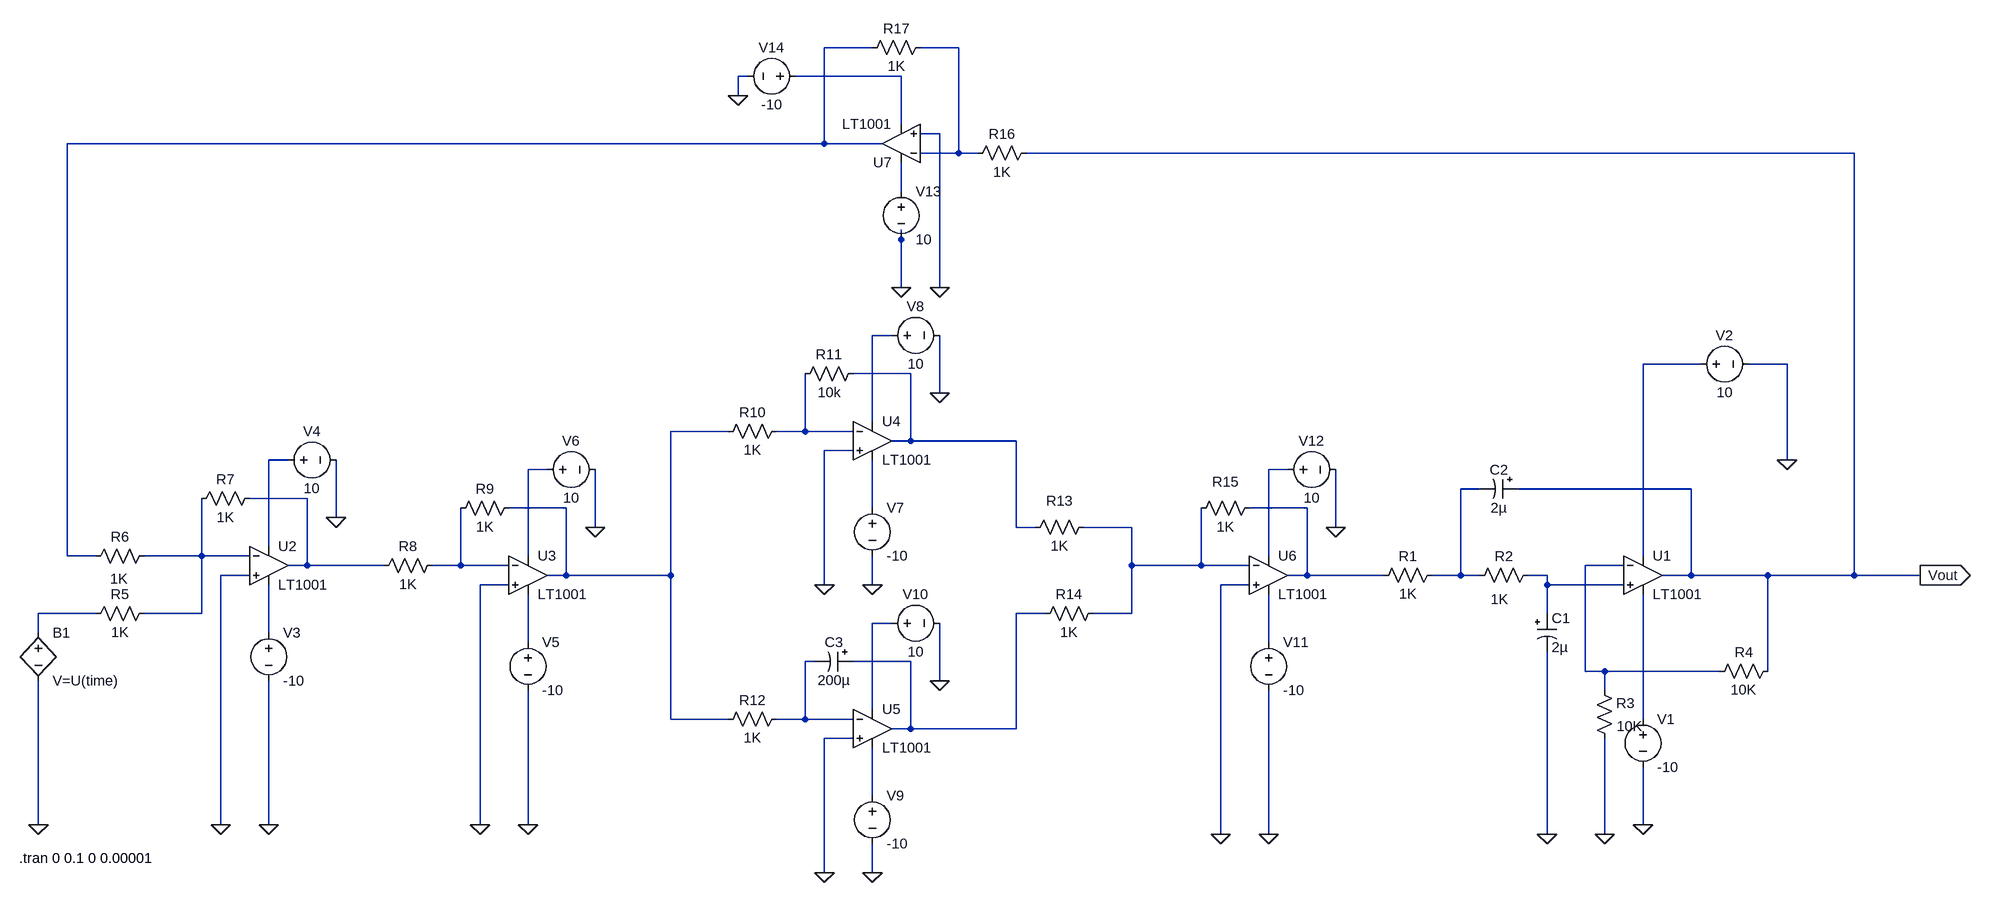
[diagram p0: schematic EC5030_Design Project_2021E171_Design2_Task2.asc]
EC5030_Design Project_2021E171_Design2_Task2.asc, the LTspice schematic file:
Version 4
SHEET 1 2368 1044
WIRE 496 -352 416 -352
WIRE 640 -352 576 -352
WIRE 288 -304 272 -304
WIRE 544 -304 368 -304
WIRE 272 -272 272 -304
WIRE 544 -224 544 -304
WIRE 608 -208 576 -208
WIRE 416 -192 416 -352
WIRE 416 -192 -896 -192
WIRE 512 -192 416 -192
WIRE 640 -176 640 -352
WIRE 640 -176 576 -176
WIRE 672 -176 640 -176
WIRE 2144 -176 752 -176
WIRE 544 -112 544 -160
WIRE 544 -32 544 -48
WIRE 544 48 544 -32
WIRE 608 48 608 -208
WIRE 528 128 496 128
WIRE 1888 176 1792 176
WIRE 2032 176 1968 176
WIRE 560 192 464 192
WIRE 608 224 608 128
WIRE 496 272 496 128
WIRE 256 288 160 288
WIRE 384 288 384 192
WIRE 384 288 336 288
WIRE 464 288 384 288
WIRE 560 304 560 192
WIRE 560 304 528 304
WIRE 736 304 560 304
WIRE 464 320 416 320
WIRE -528 336 -560 336
WIRE 2032 336 2032 176
WIRE -96 352 -128 352
WIRE 1200 352 1168 352
WIRE 1520 384 1488 384
WIRE 1872 384 1584 384
WIRE -496 400 -592 400
WIRE -64 416 -160 416
WIRE 496 416 496 336
WIRE 1232 416 1136 416
WIRE -448 432 -448 336
WIRE -16 448 -16 352
WIRE 736 448 736 304
WIRE 768 448 736 448
WIRE 928 448 848 448
WIRE 1280 448 1280 352
WIRE -560 480 -560 336
WIRE -896 496 -896 -192
WIRE -848 496 -896 496
WIRE -672 496 -672 400
WIRE -672 496 -768 496
WIRE -592 496 -672 496
WIRE -128 496 -128 352
WIRE 1168 496 1168 352
WIRE 1792 496 1792 176
WIRE -496 512 -496 400
WIRE -496 512 -528 512
WIRE -368 512 -496 512
WIRE -240 512 -240 416
WIRE -240 512 -288 512
WIRE -160 512 -240 512
WIRE 928 512 928 448
WIRE 1056 512 1056 416
WIRE 1056 512 928 512
WIRE 1136 512 1056 512
WIRE 1760 512 1696 512
WIRE -592 528 -640 528
WIRE -64 528 -64 416
WIRE -64 528 -96 528
WIRE 160 528 160 288
WIRE 160 528 -64 528
WIRE 1232 528 1232 416
WIRE 1232 528 1200 528
WIRE 1360 528 1232 528
WIRE 1488 528 1488 384
WIRE 1488 528 1440 528
WIRE 1520 528 1488 528
WIRE 1632 528 1600 528
WIRE 1872 528 1872 384
WIRE 1872 528 1824 528
WIRE 2000 528 1872 528
WIRE 2144 528 2144 -176
WIRE 2144 528 2000 528
WIRE 2256 528 2144 528
WIRE -160 544 -208 544
WIRE 416 544 416 320
WIRE 496 544 496 496
WIRE 1136 544 1088 544
WIRE 1632 544 1632 528
WIRE 1760 544 1632 544
WIRE -848 592 -944 592
WIRE -672 592 -672 496
WIRE -672 592 -768 592
WIRE 784 592 736 592
WIRE 928 592 928 512
WIRE 928 592 864 592
WIRE 1632 592 1632 544
WIRE 528 608 496 608
WIRE -944 624 -944 592
WIRE -560 624 -560 544
WIRE -128 640 -128 560
WIRE 1168 640 1168 560
WIRE 400 672 384 672
WIRE 560 672 464 672
WIRE 1696 688 1696 512
WIRE 1728 688 1696 688
WIRE 1920 688 1728 688
WIRE 2000 688 2000 528
WIRE 608 704 608 608
WIRE 1728 720 1728 688
WIRE 496 752 496 608
WIRE 160 768 160 528
WIRE 256 768 160 768
WIRE 384 768 384 672
WIRE 384 768 336 768
WIRE 464 768 384 768
WIRE 1792 768 1792 560
WIRE 560 784 560 672
WIRE 560 784 528 784
WIRE 736 784 736 592
WIRE 736 784 560 784
WIRE 464 800 416 800
WIRE 496 896 496 816
WIRE -944 944 -944 704
WIRE -640 944 -640 528
WIRE -560 944 -560 704
WIRE -208 944 -208 544
WIRE -128 944 -128 720
WIRE 1792 944 1792 848
WIRE 1088 960 1088 544
WIRE 1168 960 1168 720
WIRE 1632 960 1632 656
WIRE 1728 960 1728 800
WIRE 416 1024 416 800
WIRE 496 1024 496 976
FLAG 1728 960 0
FLAG 1632 960 0
FLAG 1792 944 0
FLAG 2032 336 0
FLAG 1280 448 0
FLAG 1168 960 0
FLAG 1088 960 0
FLAG 608 224 0
FLAG 496 544 0
FLAG 416 544 0
FLAG -16 448 0
FLAG -128 944 0
FLAG -208 944 0
FLAG -448 432 0
FLAG -560 944 0
FLAG -640 944 0
FLAG -944 944 0
FLAG 544 48 0
FLAG 272 -272 0
FLAG 608 704 0
FLAG 496 1024 0
FLAG 416 1024 0
FLAG 608 48 0
FLAG 2256 528 Vout
IOPIN 2256 528 Out
SYMBOL voltage -560 608 R0
WINDOW 123 0 0 Left 0
WINDOW 39 0 0 Left 0
SYMATTR InstName V3
SYMATTR Value -10
SYMBOL voltage 1872 176 R270
WINDOW 0 32 56 VTop 2
WINDOW 3 -32 56 VBottom 2
WINDOW 123 0 0 Left 0
WINDOW 39 0 0 Left 0
SYMATTR InstName V2
SYMATTR Value 10
SYMBOL res -752 480 R90
WINDOW 0 0 56 VBottom 2
WINDOW 3 39 58 VTop 2
SYMATTR InstName R6
SYMATTR Value 1K
SYMBOL polcap 1616 592 R0
SYMATTR InstName C1
SYMATTR Value 2µ
SYMBOL polcap 1584 368 R90
WINDOW 0 0 32 VBottom 2
WINDOW 3 32 32 VTop 2
SYMATTR InstName C2
SYMATTR Value 2µ
SYMBOL OpAmps\\LT1001 1792 464 R0
SYMATTR InstName U1
SYMBOL res 1712 704 R0
WINDOW 0 51 53 Bottom 2
SYMATTR InstName R3
SYMATTR Value 10K
SYMBOL res 1456 512 R90
WINDOW 0 0 56 VBottom 2
WINDOW 3 32 56 VTop 2
SYMATTR InstName R1
SYMATTR Value 1K
SYMBOL OpAmps\\LT1001 1168 464 R0
SYMATTR InstName U6
SYMBOL voltage 1792 752 R0
WINDOW 123 0 0 Left 0
WINDOW 39 0 0 Left 0
SYMATTR InstName V1
SYMATTR Value -10
SYMBOL voltage 512 608 R270
WINDOW 0 32 56 VTop 2
WINDOW 3 -32 56 VBottom 2
WINDOW 123 0 0 Left 0
WINDOW 39 0 0 Left 0
SYMATTR InstName V10
SYMATTR Value 10
SYMBOL res 2016 672 R90
WINDOW 0 0 56 VBottom 2
WINDOW 3 32 56 VTop 2
SYMATTR InstName R4
SYMATTR Value 10K
SYMBOL res 480 176 R90
WINDOW 0 0 56 VBottom 2
WINDOW 3 32 56 VTop 2
SYMATTR InstName R11
SYMATTR Value 10k
SYMBOL OpAmps\\LT1001 496 240 R0
SYMATTR InstName U4
SYMBOL voltage -128 624 R0
WINDOW 123 0 0 Left 0
WINDOW 39 0 0 Left 0
SYMATTR InstName V5
SYMATTR Value -10
SYMBOL voltage -544 336 R270
WINDOW 0 32 56 VTop 2
WINDOW 3 -32 56 VBottom 2
WINDOW 123 0 0 Left 0
WINDOW 39 0 0 Left 0
SYMATTR InstName V4
SYMATTR Value 10
SYMBOL res -272 496 R90
WINDOW 0 0 56 VBottom 2
WINDOW 3 32 56 VTop 2
SYMATTR InstName R8
SYMATTR Value 1K
SYMBOL res -144 400 R90
WINDOW 0 0 56 VBottom 2
WINDOW 3 32 56 VTop 2
SYMATTR InstName R9
SYMATTR Value 1K
SYMBOL OpAmps\\LT1001 -128 464 R0
SYMATTR InstName U3
SYMBOL voltage 496 400 R0
WINDOW 123 0 0 Left 0
WINDOW 39 0 0 Left 0
SYMATTR InstName V7
SYMATTR Value -10
SYMBOL voltage 512 128 R270
WINDOW 0 32 56 VTop 2
WINDOW 3 -32 56 VBottom 2
WINDOW 123 0 0 Left 0
WINDOW 39 0 0 Left 0
SYMATTR InstName V8
SYMATTR Value 10
SYMBOL res 352 272 R90
WINDOW 0 0 56 VBottom 2
WINDOW 3 32 56 VTop 2
SYMATTR InstName R10
SYMATTR Value 1K
SYMBOL res 1152 400 R90
WINDOW 0 -12 56 VBottom 2
WINDOW 3 32 56 VTop 2
SYMATTR InstName R15
SYMATTR Value 1K
SYMBOL OpAmps\\LT1001 -560 448 R0
SYMATTR InstName U2
SYMBOL voltage 1168 624 R0
WINDOW 123 0 0 Left 0
WINDOW 39 0 0 Left 0
SYMATTR InstName V11
SYMATTR Value -10
SYMBOL voltage 1184 352 R270
WINDOW 0 32 56 VTop 2
WINDOW 3 -32 56 VBottom 2
WINDOW 123 0 0 Left 0
WINDOW 39 0 0 Left 0
SYMATTR InstName V12
SYMATTR Value 10
SYMBOL res 352 752 R90
WINDOW 0 0 56 VBottom 2
WINDOW 3 32 56 VTop 2
SYMATTR InstName R12
SYMATTR Value 1K
SYMBOL res -576 384 R90
WINDOW 0 0 56 VBottom 2
WINDOW 3 32 56 VTop 2
SYMATTR InstName R7
SYMATTR Value 1K
SYMBOL res -752 576 R90
WINDOW 0 0 56 VBottom 2
WINDOW 3 32 56 VTop 2
SYMATTR InstName R5
SYMATTR Value 1K
SYMBOL res 592 -368 R90
WINDOW 0 0 56 VBottom 2
WINDOW 3 32 56 VTop 2
SYMATTR InstName R17
SYMATTR Value 1K
SYMBOL OpAmps\\LT1001 544 -128 R180
SYMATTR InstName U7
SYMBOL res 1616 512 R90
WINDOW 0 0 56 VBottom 2
WINDOW 3 41 63 VTop 2
SYMATTR InstName R2
SYMATTR Value 1K
SYMBOL res 768 -192 R90
WINDOW 0 0 56 VBottom 2
WINDOW 3 32 56 VTop 2
SYMATTR InstName R16
SYMATTR Value 1K
SYMBOL voltage 544 -128 R0
WINDOW 123 0 0 Left 0
WINDOW 39 0 0 Left 0
SYMATTR InstName V13
SYMATTR Value 10
SYMBOL voltage 384 -304 R90
WINDOW 0 -32 56 VBottom 2
WINDOW 3 32 56 VTop 2
WINDOW 123 0 0 Left 0
WINDOW 39 0 0 Left 0
SYMATTR InstName V14
SYMATTR Value -10
SYMBOL OpAmps\\LT1001 496 720 R0
SYMATTR InstName U5
SYMBOL voltage 496 880 R0
WINDOW 123 0 0 Left 0
WINDOW 39 0 0 Left 0
SYMATTR InstName V9
SYMATTR Value -10
SYMBOL voltage -112 352 R270
WINDOW 0 32 56 VTop 2
WINDOW 3 -32 56 VBottom 2
WINDOW 123 0 0 Left 0
WINDOW 39 0 0 Left 0
SYMATTR InstName V6
SYMATTR Value 10
SYMBOL polcap 464 656 R90
WINDOW 0 0 32 VBottom 2
WINDOW 3 32 32 VTop 2
SYMATTR InstName C3
SYMATTR Value 200µ
SYMBOL res 880 576 R90
WINDOW 0 0 56 VBottom 2
WINDOW 3 32 56 VTop 2
SYMATTR InstName R14
SYMATTR Value 1K
SYMBOL res 864 432 R90
WINDOW 0 -12 56 VBottom 2
WINDOW 3 32 56 VTop 2
SYMATTR InstName R13
SYMATTR Value 1K
SYMBOL bv -944 608 R0
SYMATTR InstName B1
SYMATTR Value V=U(time)
TEXT -976 1000 Left 2 !.tran 0 0.1 0 0.00001

The netlist it stands for:
* EC5030_Design Project_2021E171_Design2_Task2.asc
V3 N025 0 -10
V2 N006 0 10
R6 N018 N001 1K
C1 N021 0 2µ
C2 Vout N013 2µ
XU1 N021 N020 N006 N029 Vout LT1001  ; pins In+ In- V+ V- OUT
R3 N020 0 10K
R1 N013 N016 1K
XU6 0 N017 N012 N027 N016 LT1001  ; pins In+ In- V+ V- OUT
V1 N029 0 -10
V10 N024 0 10
R4 Vout N020 10K
R11 N007 N009 10k
XU4 0 N009 N005 N015 N007 LT1001  ; pins In+ In- V+ V- OUT
V5 N026 0 -10
V4 N010 0 10
R8 N019 N014 1K
R9 N008 N019 1K
XU3 0 N019 N011 N026 N008 LT1001  ; pins In+ In- V+ V- OUT
V7 N015 0 -10
V8 N005 0 10
R10 N009 N008 1K
R15 N016 N017 1K
XU2 0 N018 N010 N025 N014 LT1001  ; pins In+ In- V+ V- OUT
V11 N027 0 -10
V12 N012 0 10
R12 N028 N008 1K
R7 N014 N018 1K
R5 N018 N022 1K
R17 N002 N001 1K
XU7 0 N002 N004 N003 N001 LT1001  ; pins In+ In- V+ V- OUT
R2 N021 N013 1K
R16 Vout N002 1K
V13 N004 0 10
V14 N003 0 -10
XU5 0 N028 N024 N030 N023 LT1001  ; pins In+ In- V+ V- OUT
V9 N030 0 -10
V6 N011 0 10
C3 N023 N028 200µ
R14 N017 N023 1K
R13 N017 N007 1K
B1 N022 0 V=U(time)
.tran 0 0.1 0 0.00001
.lib LTC.lib
.backanno
.end